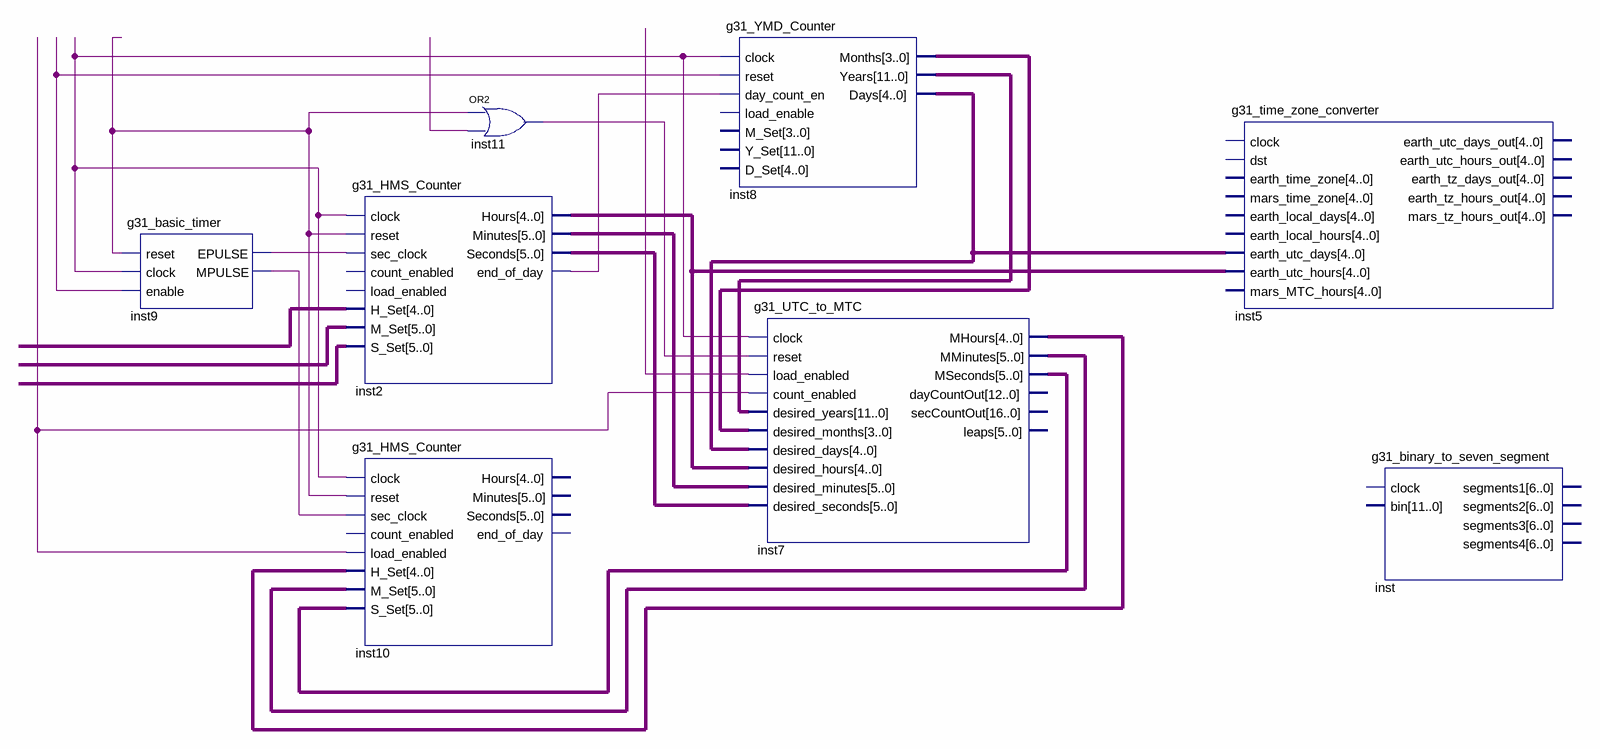
[diagram p0: schematic sheet]
// Quartus schematic Lab5-1_Complete.bdf as structural Verilog: 8 symbols, 0 pins
module \Lab5-1_Complete  (
);

  wire inst2_end_of_day, inst9_epulse, inst9_mpulse, inst11_out, undriven_2, undriven_3, undriven_4,
       undriven_5, undriven_6, undriven_7;
  wire [3:0] inst8_months;
  wire [4:0] inst2_hours, inst7_mhours, inst8_days, undriven_8;
  wire [5:0] inst2_minutes, inst2_seconds, inst7_mminutes, inst7_mseconds, undriven, undriven_9;
  wire [11:0] inst8_years;

  g31_basic_timer inst9 (
    .reset(undriven_5), .clock(undriven_2), .enable(undriven_3), .EPULSE(inst9_epulse), .MPULSE(inst9_mpulse));
  g31_HMS_Counter inst2 (
    .clock(undriven_2), .reset(undriven_5), .sec_clock(inst9_epulse), .H_Set(undriven_8), .M_Set(undriven_9),
    .S_Set(undriven), .Hours(inst2_hours), .Minutes(inst2_minutes), .Seconds(inst2_seconds),
    .end_of_day(inst2_end_of_day));  // open: count_enabled, load_enabled
  g31_HMS_Counter inst10 (
    .clock(undriven_2), .reset(undriven_5), .sec_clock(inst9_mpulse), .load_enabled(undriven_7),
    .H_Set(inst7_mhours), .M_Set(inst7_mminutes), .S_Set(inst7_mseconds));  // open: count_enabled, Hours, Minutes, Seconds, end_of_day
  or inst11 (inst11_out, undriven_5, undriven_6);
  g31_YMD_Counter inst8 (
    .clock(undriven_2), .reset(undriven_3), .day_count_en(inst2_end_of_day), .Months(inst8_months),
    .Years(inst8_years), .Days(inst8_days));  // open: load_enable, M_Set, Y_Set, D_Set
  g31_UTC_to_MTC inst7 (
    .clock(undriven_2), .reset(inst11_out), .load_enabled(undriven_4), .count_enabled(undriven_7),
    .desired_years(inst8_years), .desired_months(inst8_months), .desired_days(inst8_days),
    .desired_hours(inst2_hours), .desired_minutes(inst2_minutes), .desired_seconds(inst2_seconds),
    .MHours(inst7_mhours), .MMinutes(inst7_mminutes), .MSeconds(inst7_mseconds));  // open: dayCountOut, secCountOut, leaps
  g31_time_zone_converter inst5 (
    .earth_utc_days(inst8_days), .earth_utc_hours(inst2_hours));  // open: clock, dst, earth_time_zone, mars_time_zone, earth_local_days, earth_local_hours, mars_MTC_hours, earth_utc_days_out, earth_utc_hours_out, earth_tz_days_out, earth_tz_hours_out, mars_tz_hours_out
  g31_binary_to_seven_segment inst ();  // open: clock, bin, segments1, segments2, segments3, segments4
endmodule
